# Altium schematic sheet YiWallet-Enc-memory.SchDoc
size A4
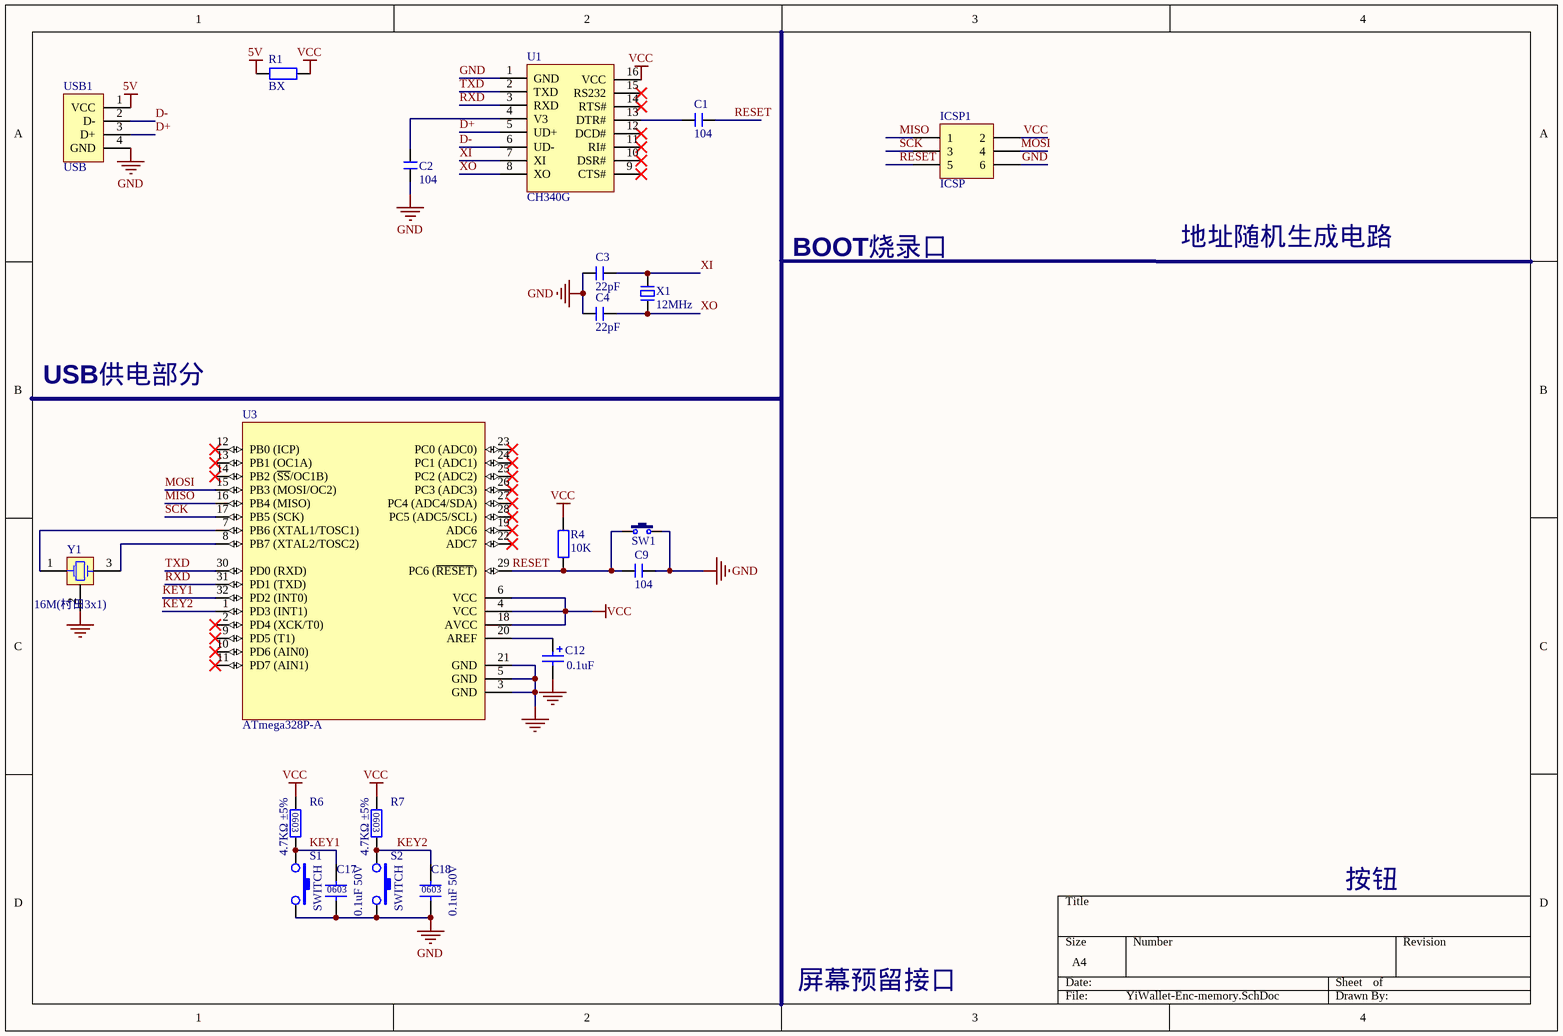
[diagram p0: YiWallet-Enc-memory.SchDoc]

## Parts
C1  104  [C 0603_L]
C2  104  [C 0603_L]
C3  22pF  [C 0603_L]
C4  22pF  [C 0603_L]
C9  104  [C 0603_L]
C12  0.1uF  [C 0603_L]
C17  0.1uF 50V  [C 0603_L]
C18  0.1uF 50V  [C 0603_L]
ICSP1  ICSP  [HDR2X3]
R1  BX  [R 0603_L]
R4  10K  [R 0603_L]
R6  4.7KΩ ±5%  [C 0603_L]
R7  4.7KΩ ±5%  [C 0603_L]
S1  SWITCH  [TSW 3*6*4.3-S-W]
S2  SWITCH  [TSW 3*6*4.3-S-W]
SW1  3x6x5  [TSW 3*6*4.3-S-W]  (value not drawn)
U1  CH340G  [SO-16]
U3  ATmega328P-A  [TQFP32-7*7]
USB1  USB  [USB_A/P_A]
X1  12MHz  [OSC HC-49S]
Y1  16M(村田3x1)  [X-CPX20]

## Nets
5V: R1.1 USB1.1(VCC)
GND: C2.1 C3.1 C4.1 C9.2 C12.2 C17.2 C18.2 ICSP1.6 S1.1 S2.1 SW1.2 U1.1(GND) U3.3(GND) U3.5(GND) U3.21(GND) USB1.4(GND) Y1.2(COM)
VCC: ICSP1.2 R1.2 R4.2 R6.1 R7.1 U1.16(VCC) U3.4(VCC) U3.6(VCC) U3.18(AVCC)
D+: U1.5(UD+) USB1.3(D+)
D-: U1.6(UD-) USB1.2(D-)
KEY1: C17.1 R6.2 S1.2 U3.32(PD2_(INT0))
KEY2: C18.1 R7.2 S2.2 U3.1(PD3_(INT1))
MISO: ICSP1.1 U3.16(PB4_(MISO))
MOSI: ICSP1.4 U3.15(PB3_(MOSI/OC2))
RESET: C1.2 C9.1 ICSP1.5 R4.1 SW1.1 U3.29(PC6_(~{RESET}))
RXD: U1.3(RXD) U3.31(PD1_(TXD))
SCK: ICSP1.3 U3.17(PB5_(SCK))
TXD: U1.2(TXD) U3.30(PD0_(RXD))
XI: C3.2 U1.7(XI) X1.2
XO: C4.2 U1.8(XO) X1.1
NetC1_1: C1.1 U1.13(DTR#)
NetC2_2: C2.2 U1.4(V3)
NetC12_1: C12.1 U3.20(AREF)
NetU3_7: U3.7(PB6_(XTAL1/TOSC1)) Y1.1(OSC1)
NetU3_8: U3.8(PB7_(XTAL2/TOSC2)) Y1.3(OSC2)

Not connected (* = marked no-connect by the designer): U1 9(CTS#)* 10(DSR#)* 11(RI#)* 12(DCD#)* 14(RTS#)* 15(RS232)*; U3 2(PD4_(XCK/T0))* 9(PD5_(T1))* 10(PD6_(AIN0))* 11(PD7_(AIN1))* 12(PB0_(ICP))* 13(PB1_(OC1A))* 14(PB2_(~{SS}/OC1B))* 19(ADC6)* 22(ADC7)* 23(PC0_(ADC0))* 24(PC1_(ADC1))* 25(PC2_(ADC2))* 26(PC3_(ADC3))* 27(PC4_(ADC4/SDA))* 28(PC5_(ADC5/SCL))*

## Notes on the sheet
- 地址随机生成电路
- BOOT烧录口
- USB供电部分
- 按钮
- 屏幕预留接口
- (in symbol C-0.1uF 50V 0603) 0603
- (in symbol R-4K7 0603 5%) 0603

## Library data of the parts
C1-C4 C9 = C: 无极性贴片电容; 版权归属: 源创客; BOM名称: 无极性贴片电容; 学习资源: www.ooocke.com
C12 = Cap Pol3: Polarized Capacitor (Surface Mount); Published: 8-Jun-2000; Revision: July-2002: Re-released for DXP Platform.; Publisher: Altium Limited; Value: 0.1uF
C17 C18 = C-0.1uF 50V 0603: 贴片电容 0.1uF 50V ±10% -55~+125℃ 0603 X7R CL10B104KB8NNNC; LH: C01-100N26-100; U_TABLE: U_C
ICSP1 = Header 3X2: Header, 3-Pin, Dual row; LatestRevisionDate: 17-Jul-2002; LatestRevisionNote: Re-released for DXP Platform.; Publisher: Altium Limited
R1 R4 = R: 贴片电阻; 版权归属: 源创客; BOM名称: 贴片电阻; 学习资源: www.ooocke.com
R6 R7 = R-4K7 0603 5%: 贴片电阻 4.7KΩ 1/10W ±5% ±200ppm 0603; LH: R01-4K7026-100; U_TABLE: U_R
S1 S2 = SW_PB6.2*6.2_5: 开关（轻触）; LH: Y07-031-0000; U_TABLE: U_SW; U_ITEM_ID（item_id）: Part00058227; U_OBJECT_NAME（物料名称）: CL710N99-6循显插件轻触开关; U_CL2_ITEMM_00（物料编码）: 20110000000004; U_CL2_ITEMR_00（物料描述）: 插件轻触开关 TS-1070 6.2*6.2*5mm 高; U_1002（指定生产商）: 浙江开拓数码科技有限公司; U_200002（型号）: TS-1070; U_200140（总高(mm)）: 5.00000000000000; U_200141（柄长(mm)）: 0.000000000000000; U_200084（尺寸(mm)）: 6.2*6.2
SW1 = TSW 3x6: 3x6轻触开关; 版权归属: 源创客; BOM名称: 3x6轻触开关; 学习资源: www.ooocke.com
U3 = ATmega8-16AC: 8-Bit AVR Microcontroller with 8K Bytes of In-System Programmable Flash Memory
USB1 = USB-A/P: USB-A型公接口; 版权归属: 源创客; BOM名称: USB-A型公接口; 学习资源: www.ooocke.com
X1 = XTAL-2P: 2脚无源脚晶振; 版权归属: 源创客; BOM名称: 2脚无源脚晶振; 学习资源: www.ooocke.com
Y1 = ECS-35-17-4-3IL: Crystal Oscillator, 3rd In-Line Lead Version; Published: 17-Jul-2002; Datasheet: Latest Revision: 18-Apr-2000; Package Reference: HC-49US; Publisher: Altium Limited